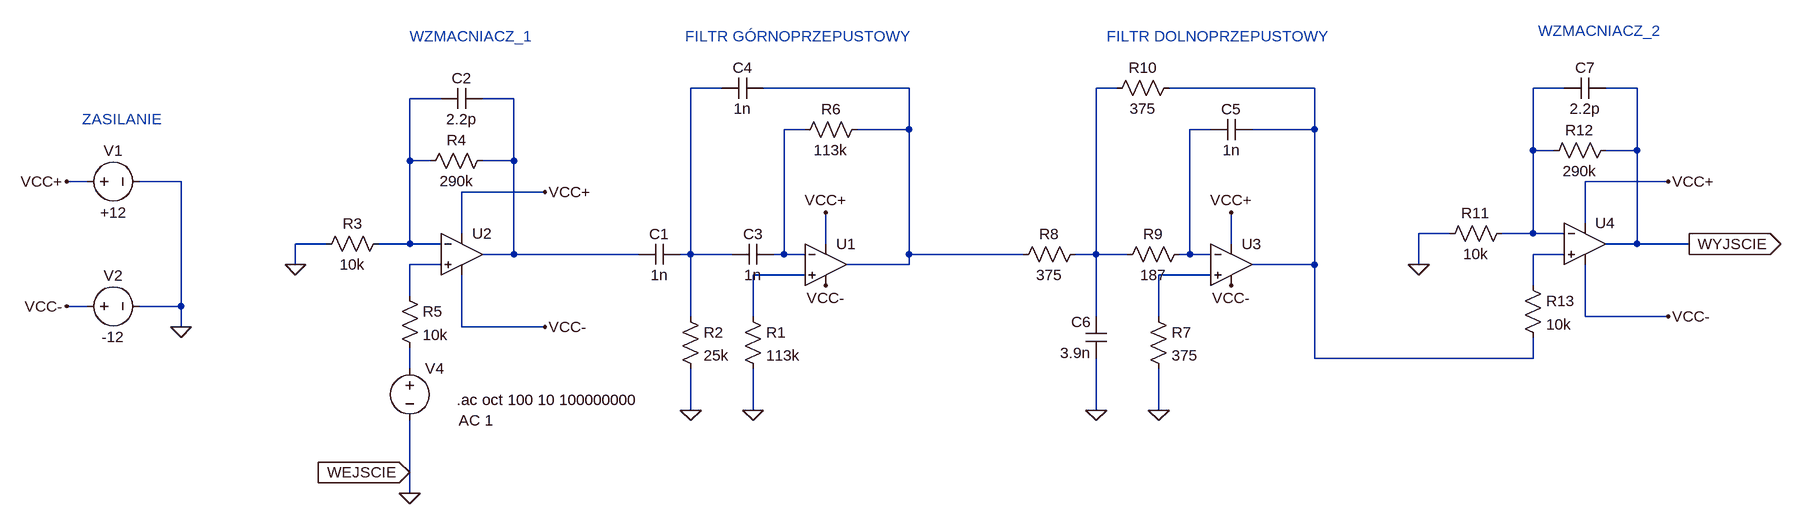
[diagram p0: schematic wyladowania.asc]
wyladowania.asc, the LTspice schematic file:
Version 4
SHEET 1 2708 1284
WIRE 960 400 912 400
WIRE 1248 400 1024 400
WIRE 1568 400 1536 400
WIRE 1872 400 1648 400
WIRE 2256 400 2208 400
WIRE 2368 400 2320 400
WIRE 528 416 480 416
WIRE 640 416 592 416
WIRE 1088 464 1056 464
WIRE 1248 464 1248 400
WIRE 1248 464 1168 464
WIRE 1712 464 1680 464
WIRE 1872 464 1872 400
WIRE 1872 464 1776 464
WIRE 2208 496 2208 400
WIRE 2240 496 2208 496
WIRE 2368 496 2368 400
WIRE 2368 496 2320 496
WIRE 480 512 480 416
WIRE 512 512 480 512
WIRE 640 512 640 416
WIRE 640 512 592 512
WIRE -16 544 -48 544
WIRE 128 544 64 544
WIRE 2416 544 2288 544
WIRE 688 560 560 560
WIRE 2288 608 2288 544
WIRE 560 624 560 560
WIRE 2080 624 2032 624
WIRE 2208 624 2208 496
WIRE 2208 624 2160 624
WIRE 2256 624 2208 624
WIRE 352 640 304 640
WIRE 480 640 480 512
WIRE 480 640 432 640
WIRE 528 640 480 640
WIRE 1120 640 1120 592
WIRE 1744 640 1744 592
WIRE 2368 640 2368 496
WIRE 2368 640 2320 640
WIRE 2448 640 2368 640
WIRE 640 656 640 512
WIRE 640 656 592 656
WIRE 832 656 640 656
WIRE 912 656 912 400
WIRE 912 656 896 656
WIRE 976 656 912 656
WIRE 1056 656 1056 464
WIRE 1056 656 1040 656
WIRE 1088 656 1056 656
WIRE 1248 656 1248 464
WIRE 1424 656 1248 656
WIRE 1536 656 1536 400
WIRE 1536 656 1504 656
WIRE 1584 656 1536 656
WIRE 1680 656 1680 464
WIRE 1680 656 1664 656
WIRE 1712 656 1680 656
WIRE 2256 656 2208 656
WIRE 304 672 304 640
WIRE 528 672 480 672
WIRE 1248 672 1248 656
WIRE 1248 672 1152 672
WIRE 1872 672 1872 464
WIRE 1872 672 1776 672
WIRE 2032 672 2032 624
WIRE 1088 688 1008 688
WIRE 1712 688 1632 688
WIRE 2208 704 2208 656
WIRE 480 720 480 672
WIRE -16 736 -48 736
WIRE 128 736 128 544
WIRE 128 736 64 736
WIRE 912 752 912 656
WIRE 1008 752 1008 688
WIRE 1536 752 1536 656
WIRE 1632 752 1632 688
WIRE 2288 752 2288 672
WIRE 2416 752 2288 752
WIRE 128 768 128 736
WIRE 560 768 560 688
WIRE 688 768 560 768
WIRE 1872 816 1872 672
WIRE 2208 816 2208 784
WIRE 2208 816 1872 816
WIRE 480 832 480 800
WIRE 912 896 912 832
WIRE 1008 896 1008 832
WIRE 1536 896 1536 816
WIRE 1632 896 1632 832
WIRE 480 992 480 912
WIRE 480 1024 480 992
FLAG 304 672 0
FLAG 688 560 VCC+
FLAG 688 768 VCC-
FLAG -48 544 VCC+
FLAG -48 736 VCC-
FLAG 128 768 0
FLAG 912 896 0
FLAG 1008 896 0
FLAG 1120 592 VCC+
FLAG 1120 704 VCC-
FLAG 1536 896 0
FLAG 1632 896 0
FLAG 1744 592 VCC+
FLAG 1744 704 VCC-
FLAG 480 1024 0
FLAG 2416 544 VCC+
FLAG 2416 752 VCC-
FLAG 2032 672 0
FLAG 2448 640 WYJSCIE
IOPIN 2448 640 Out
FLAG 480 992 WEJSCIE
IOPIN 480 992 In
SYMBOL res 448 624 R90
WINDOW 0 0 56 VBottom 2
WINDOW 3 32 56 VTop 2
SYMATTR InstName R3
SYMATTR Value 10k
SYMBOL res 608 496 R90
WINDOW 0 0 56 VBottom 2
WINDOW 3 32 56 VTop 2
SYMATTR InstName R4
SYMATTR Value 290k
SYMBOL Opamps\\UniversalOpamp2 560 656 R0
SYMATTR InstName U2
SYMBOL res 464 704 R0
SYMATTR InstName R5
SYMATTR Value 10k
SYMBOL voltage 480 816 R0
WINDOW 3 24 44 Left 2
WINDOW 123 75 96 Left 2
WINDOW 39 0 0 Left 2
SYMATTR Value ""
SYMATTR Value2 AC 1
SYMATTR InstName V4
SYMBOL cap 592 400 R90
WINDOW 0 0 32 VBottom 2
WINDOW 3 32 32 VTop 2
SYMATTR InstName C2
SYMATTR Value 2.2p
SYMBOL cap 896 640 R90
WINDOW 0 0 32 VBottom 2
WINDOW 3 32 32 VTop 2
SYMATTR InstName C1
SYMATTR Value 1n
SYMBOL cap 1040 640 R90
WINDOW 0 0 32 VBottom 2
WINDOW 3 32 32 VTop 2
SYMATTR InstName C3
SYMATTR Value 1n
SYMBOL Opamps\\UniversalOpamp2 1120 672 R0
SYMATTR InstName U1
SYMBOL voltage -32 544 R270
WINDOW 0 32 56 VTop 2
WINDOW 3 -32 56 VBottom 2
WINDOW 123 0 0 Left 2
WINDOW 39 0 0 Left 2
SYMATTR InstName V1
SYMATTR Value +12
SYMBOL voltage -32 736 R270
WINDOW 0 32 56 VTop 2
WINDOW 3 -32 56 VBottom 2
WINDOW 123 0 0 Left 2
WINDOW 39 0 0 Left 2
SYMATTR InstName V2
SYMATTR Value -12
SYMBOL res 992 736 R0
SYMATTR InstName R1
SYMATTR Value 113k
SYMBOL res 896 736 R0
SYMATTR InstName R2
SYMATTR Value 25k
SYMBOL res 1184 448 R90
WINDOW 0 0 56 VBottom 2
WINDOW 3 32 56 VTop 2
SYMATTR InstName R6
SYMATTR Value 113k
SYMBOL cap 1024 384 R90
WINDOW 0 0 32 VBottom 2
WINDOW 3 32 32 VTop 2
SYMATTR InstName C4
SYMATTR Value 1n
SYMBOL Opamps\\UniversalOpamp2 1744 672 R0
SYMATTR InstName U3
SYMBOL res 1616 736 R0
SYMATTR InstName R7
SYMATTR Value 375
SYMBOL cap 1776 448 R90
WINDOW 0 0 32 VBottom 2
WINDOW 3 32 32 VTop 2
SYMATTR InstName C5
SYMATTR Value 1n
SYMBOL cap 1552 816 R180
WINDOW 0 24 56 Left 2
WINDOW 3 24 8 Left 2
SYMATTR InstName C6
SYMATTR Value 3.9n
SYMBOL res 1680 640 R90
WINDOW 0 0 56 VBottom 2
WINDOW 3 32 56 VTop 2
SYMATTR InstName R9
SYMATTR Value 187
SYMBOL res 1664 384 R90
WINDOW 0 0 56 VBottom 2
WINDOW 3 32 56 VTop 2
SYMATTR InstName R10
SYMATTR Value 375
SYMBOL res 1520 640 R90
WINDOW 0 0 56 VBottom 2
WINDOW 3 32 56 VTop 2
SYMATTR InstName R8
SYMATTR Value 375
SYMBOL res 2176 608 R90
WINDOW 0 0 56 VBottom 2
WINDOW 3 32 56 VTop 2
SYMATTR InstName R11
SYMATTR Value 10k
SYMBOL res 2336 480 R90
WINDOW 0 0 56 VBottom 2
WINDOW 3 32 56 VTop 2
SYMATTR InstName R12
SYMATTR Value 290k
SYMBOL Opamps\\UniversalOpamp2 2288 640 R0
SYMATTR InstName U4
SYMBOL res 2192 688 R0
SYMATTR InstName R13
SYMATTR Value 10k
SYMBOL cap 2320 384 R90
WINDOW 0 0 32 VBottom 2
WINDOW 3 32 32 VTop 2
SYMATTR InstName C7
SYMATTR Value 2.2p
TEXT 480 320 Left 2 ;WZMACNIACZ_1
TEXT 904 320 Left 2 ;FILTR GÓRNOPRZEPUSTOWY
TEXT 1552 320 Left 2 ;FILTR DOLNOPRZEPUSTOWY
TEXT 552 880 Left 2 !.ac oct 100 10 100000000
TEXT 2216 312 Left 2 ;WZMACNIACZ_2
TEXT -24 448 Left 2 ;ZASILANIE

The netlist it stands for:
* wyladowania.asc
R3 N006 0 10k
R4 N007 N006 290k
XU2 N011 N006 VCC+ VCC- N007 level.2 Avol=1Meg GBW=10Meg Slew=10Meg ilimit=25m rail=0 Vos=0 phimargin=45 en=0 enk=0 in=0 ink=0 Rin=500Meg  ; pins IN+ IN- V+ V- OUT
R5 N011 N014 10k
V4 N014 0 AC 1
C2 N007 N006 2.2p
C1 N001 N007 1n
C3 N008 N001 1n
XU1 N012 N008 VCC+ VCC- N002 level.2 Avol=1Meg GBW=10Meg Slew=10Meg ilimit=25m rail=0 Vos=0 phimargin=45 en=0 enk=0 in=0 ink=0 Rin=500Meg  ; pins IN+ IN- V+ V- OUT
V1 VCC+ 0 +12
V2 VCC- 0 -12
R1 N012 0 113k
R2 N001 0 25k
R6 N002 N008 113k
C4 N002 N001 1n
XU3 N013 N009 VCC+ VCC- N004 level.2 Avol=1Meg GBW=10Meg Slew=10Meg ilimit=25m rail=0 Vos=0 phimargin=45 en=0 enk=0 in=0 ink=0 Rin=500Meg  ; pins IN+ IN- V+ V- OUT
R7 N013 0 375
C5 N004 N009 1n
C6 0 N003 3.9n
R9 N009 N003 187
R10 N004 N003 375
R8 N003 N002 375
R11 N005 0 10k
R12 WYJSCIE N005 290k
XU4 N010 N005 VCC+ VCC- WYJSCIE level.2 Avol=1Meg GBW=10Meg Slew=10Meg ilimit=25m rail=0 Vos=0 phimargin=45 en=0 enk=0 in=0 ink=0 Rin=500Meg  ; pins IN+ IN- V+ V- OUT
R13 N010 N004 10k
C7 WYJSCIE N005 2.2p
* WZMACNIACZ_1
* FILTR GÓRNOPRZEPUSTOWY
* FILTR DOLNOPRZEPUSTOWY
.ac oct 100 10 100000000
* WZMACNIACZ_2
* ZASILANIE
.lib UniversalOpamps2.sub
.backanno
.end